# EasyEDA schematic SCH_LM2596 Board V1_2023-05-05.json
TITLE: Sheet_1; REV: 1.0; Date: 2023-03-07; Sheet: 1/1; Drawn By: richwasnothere; Company: Your Company
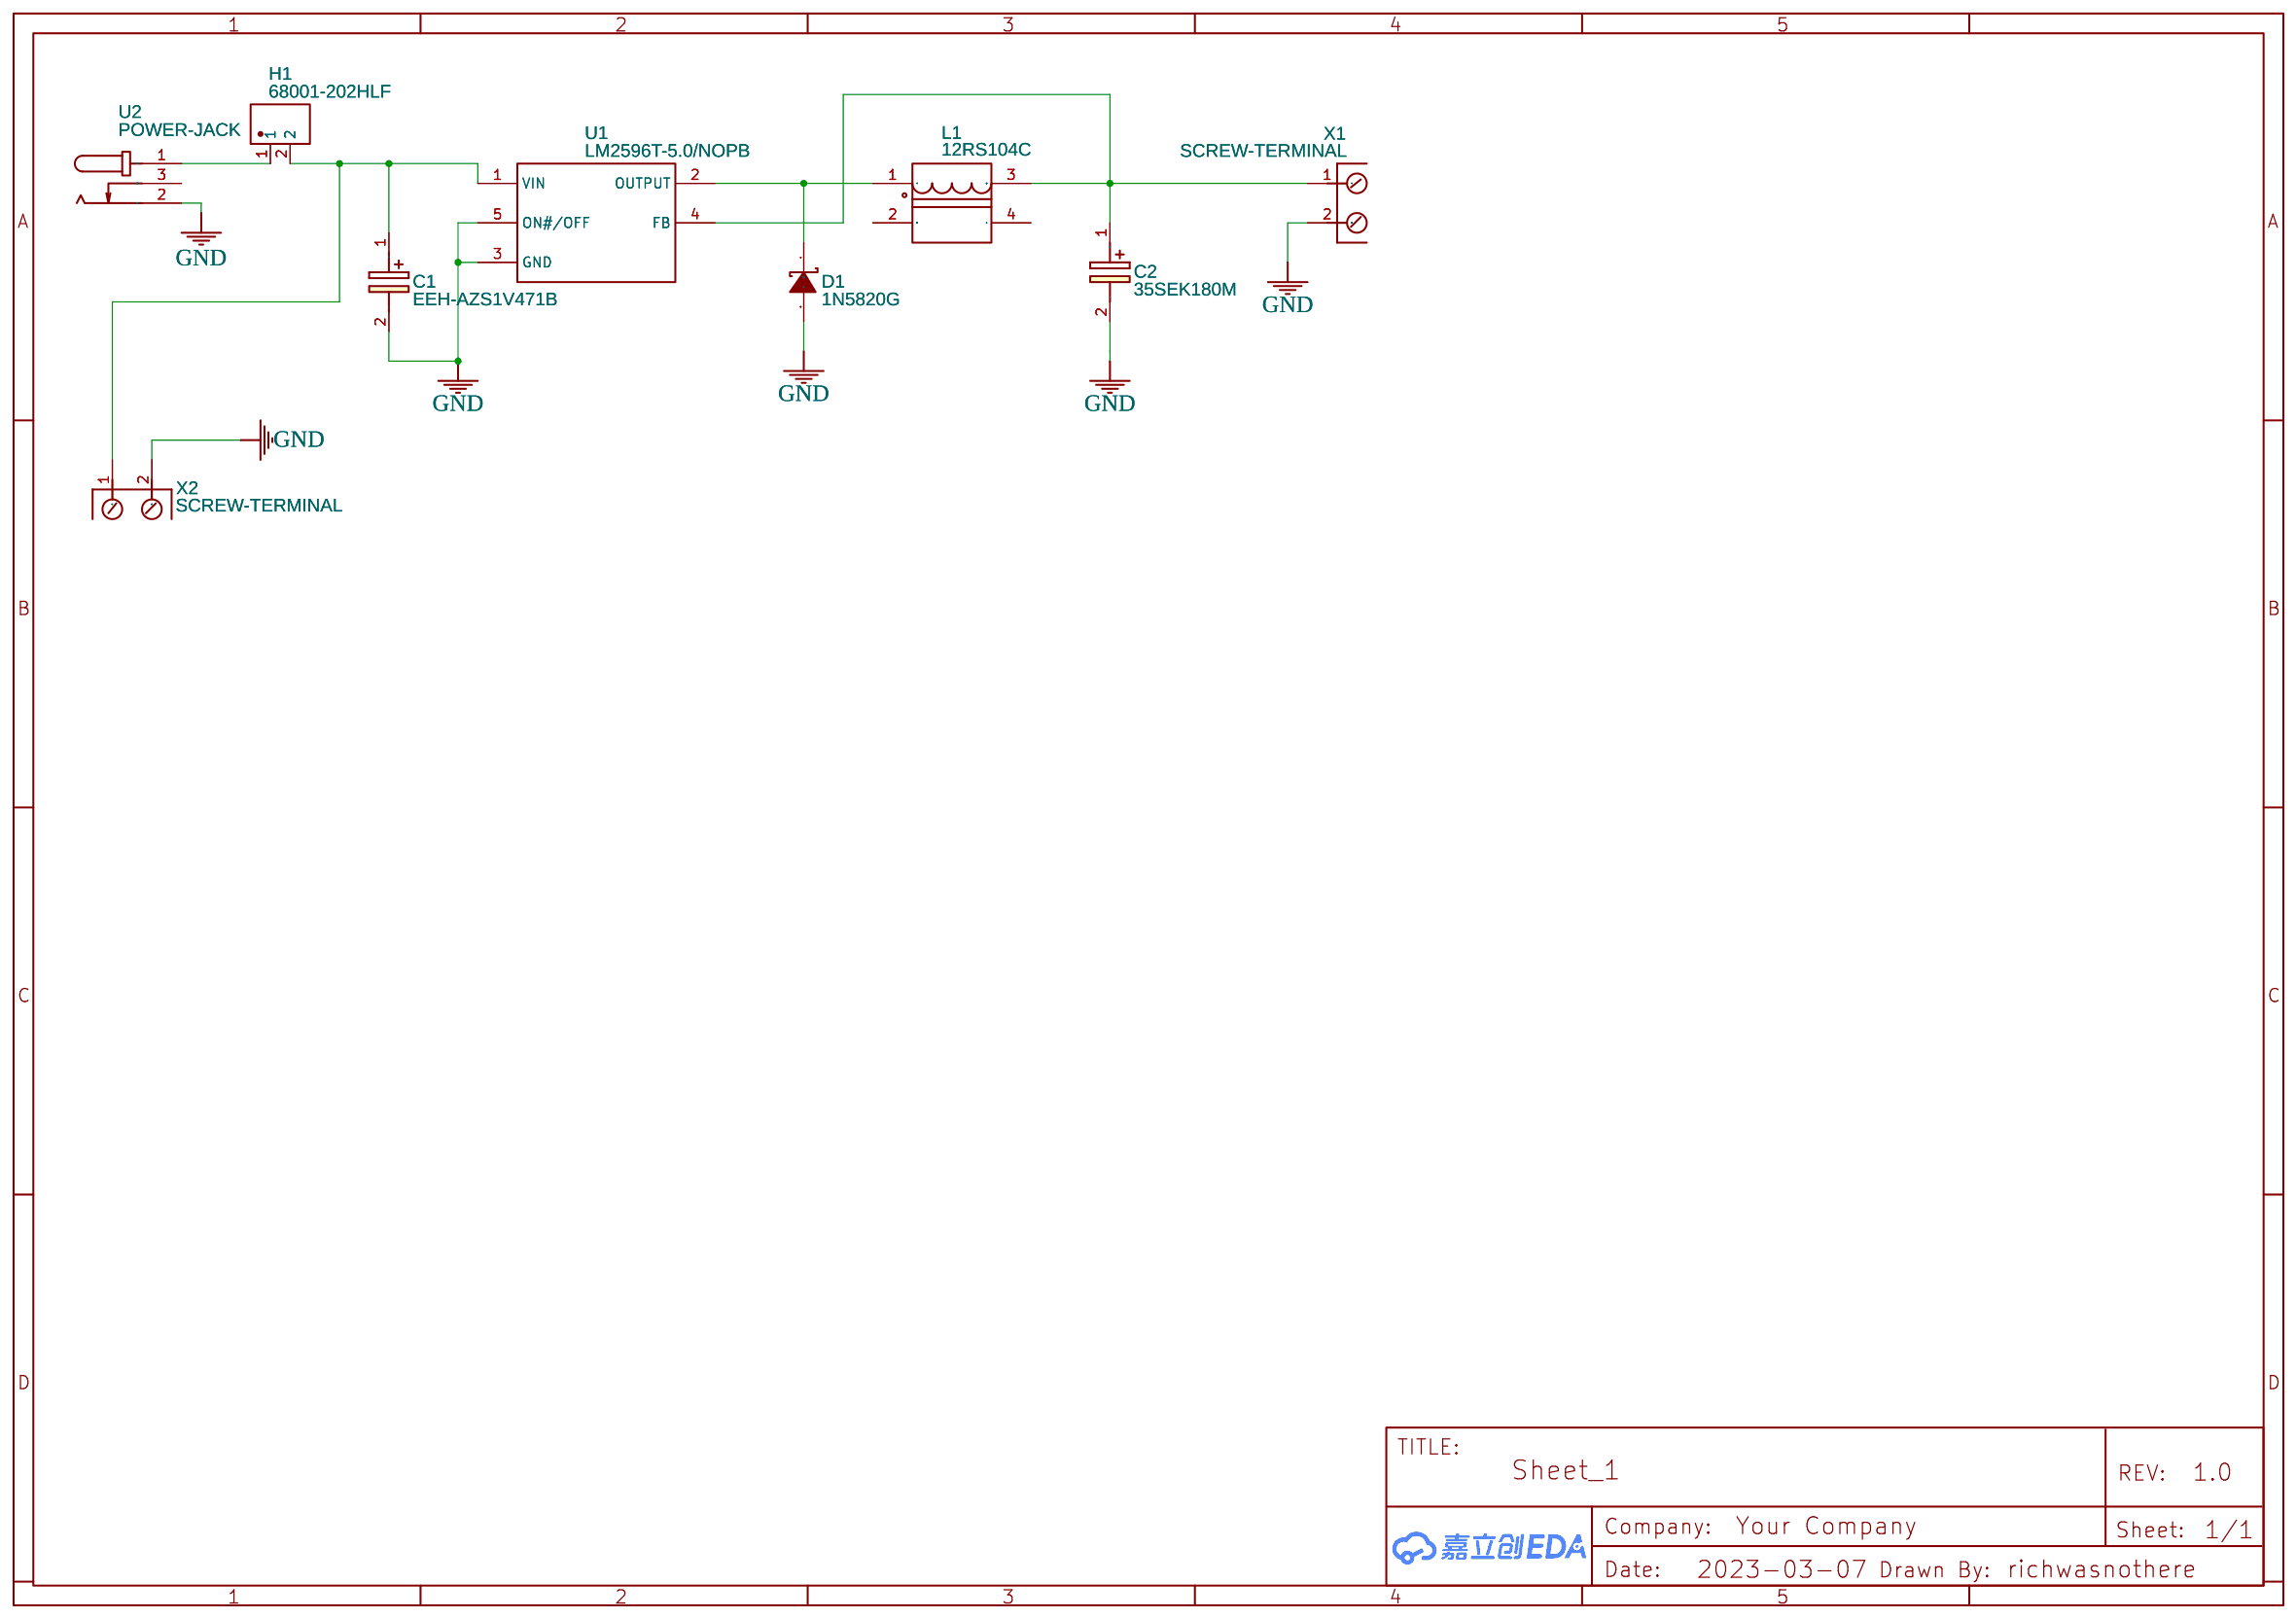
[diagram p0: schematic sheet]

## Parts
C1  EEH-AZS1V471B  [CAPPRD530W85D1000H1670]
C2  35SEK180M  [CAPPRD530W85D1000H1670]
D1  1N5820G  [DO-201AD_BD5.3-L8.4-P12.50-D1.4-RD]
H1  68001-202HLF  [HDR-TH_2P-P2.54-V-M-1]
L1  12RS104C  [IND-TH_4P-BD10.0-P5.00-D0.6-S4.00]
U1  LM2596T-5.0/NOPB  [TO-220-5_L10.5-W15.5-P1.70-TL]
U2  POWER-JACK  [DC-IN-TH_POWER-JACK]
X1  SCREW-TERMINAL  [AKL701_2_13]
X2  SCREW-TERMINAL  [AKL701_2_13]

## Library data of the parts
C1 = EEH-AZS1V471B: Contributor: richwasnothere
C2 = 35SEK180M: Contributor: richwasnothere
D1 = 1N5820G: Supplier: LCSC; Supplier Part: C95400; Manufacturer: onsemi(安森美); Contributor: LCSC; JLCPCB Part Class: Extended Part
H1 = 68001-202HLF: Supplier: LCSC; Supplier Part: C2931354; Manufacturer: Amphenol; link: https://atta.szlcsc.com/upload/public/pdf/source/20210622/C2802682_6FDB3B5212B3A503D0C35E81590DBB9A.pdf; Contributor: LCSC; JLCPCB Part Class: Extended Part
L1 = 12RS104C: Supplier: LCSC; Supplier Part: C3039630; Manufacturer: muRata(村田); link: https://atta.szlcsc.com/upload/public/pdf/source/20220617/D710CD1DCE31B9537851463B093E0957.pdf; Contributor: lcsc; JLCPCB Part Class: Extended Part; Inductance: 100uH
U1 = LM2596T-5.0/NOPB: Supplier: LCSC; Manufacturer: TI(德州仪器); Supplier Part: C9714; JLCPCB Part Class: Extended Part
U2 = POWER-JACK: Supplier: LCSC; Supplier Part: C9900001795; Manufacturer: null; JLCPCB Part Class: Extended Part; Contributor: LCSC
X1 X2 = -: catid: 20; sourceId: PU6sECcLl; Manufacturer Part: ?

## Nets
GND: C1.2(-) C2.2(-) D1.2(A) U1.3(GND) U1.5(ON#/OFF) U2.2 X1.2 X2.2
Net-(C1-1): C1.1(+) H1.2 U1.1(VIN) X2.1
Net-(C2-1): C2.1(+) L1.3 U1.4(FB) X1.1
Net-(D1-1): D1.1(C) L1.1 U1.2(OUTPUT)
Net-(H1-1): H1.1 U2.1

Not connected (* = marked no-connect by the designer): L1 2 4; U2 3
